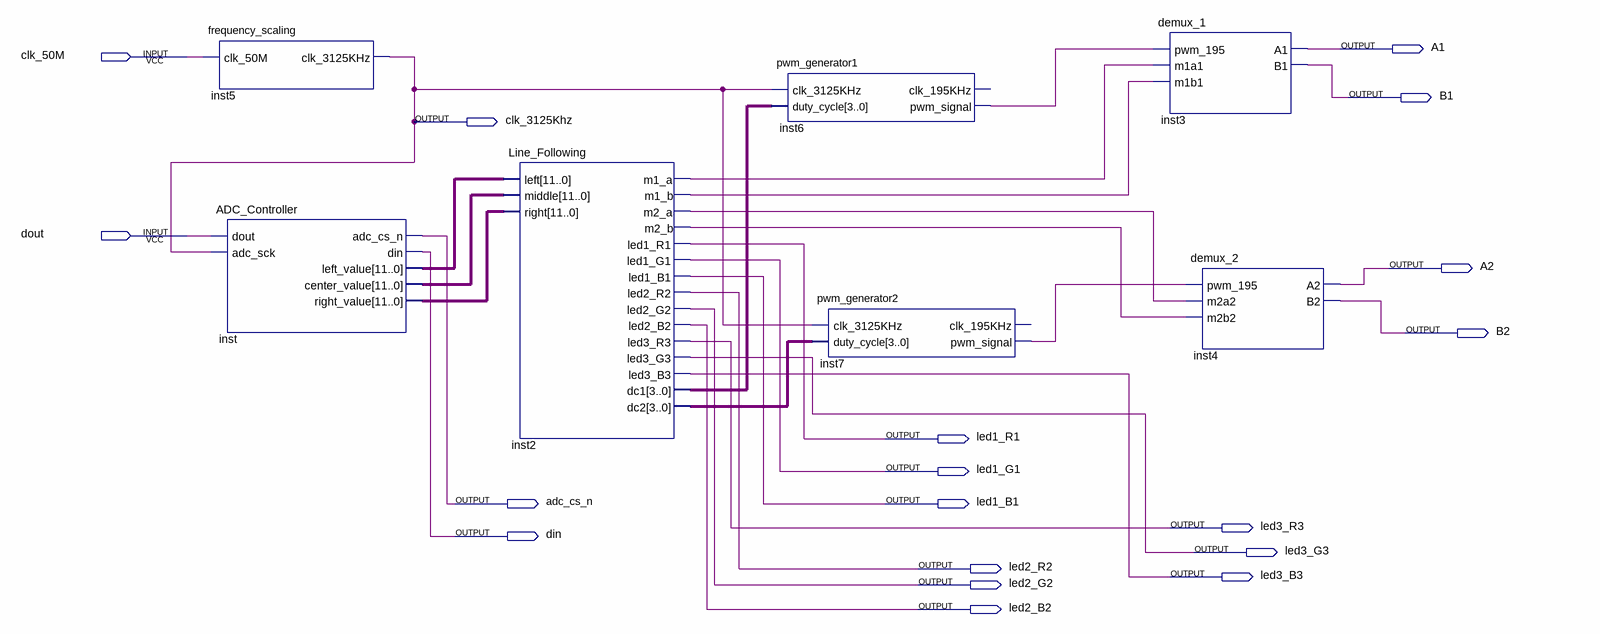
[diagram p0: schematic sheet]
// Quartus schematic line_follower1.bdf as structural Verilog: 7 symbols, 18 pins
module line_follower1 (
  input  clk_50M,
  input  dout,
  output A1,
  output B1,
  output clk_3125Khz,
  output A2,
  output B2,
  output led1_R1,
  output led1_G1,
  output adc_cs_n,
  output led1_B1,
  output led3_R3,
  output din,
  output led3_G3,
  output led2_R2,
  output led3_B3,
  output led2_G2,
  output led2_B2
);

  wire inst2_m1_a, inst2_m1_b, inst2_m2_a, inst2_m2_b, inst6_pwm_signal, inst7_pwm_signal;
  wire [3:0] inst2_dc1, inst2_dc2;
  wire [11:0] inst_center_value, inst_left_value, inst_right_value;

  frequency_scaling inst5 (.clk_50M(clk_50M), .clk_3125KHz(clk_3125Khz));
  ADC_Controller inst (
    .dout(dout), .adc_sck(clk_3125Khz), .adc_cs_n(adc_cs_n), .din(din), .left_value(inst_left_value),
    .center_value(inst_center_value), .right_value(inst_right_value));
  Line_Following inst2 (
    .left(inst_left_value), .middle(inst_center_value), .right(inst_right_value), .m1_a(inst2_m1_a),
    .m1_b(inst2_m1_b), .m2_a(inst2_m2_a), .m2_b(inst2_m2_b), .led1_R1(led1_R1), .led1_G1(led1_G1),
    .led1_B1(led1_B1), .led2_R2(led2_R2), .led2_G2(led2_G2), .led2_B2(led2_B2), .led3_R3(led3_R3),
    .led3_G3(led3_G3), .led3_B3(led3_B3), .dc1(inst2_dc1), .dc2(inst2_dc2));
  pwm_generator1 inst6 (
    .clk_3125KHz(clk_3125Khz), .duty_cycle(inst2_dc1), .pwm_signal(inst6_pwm_signal));  // open: clk_195KHz
  pwm_generator2 inst7 (
    .clk_3125KHz(clk_3125Khz), .duty_cycle(inst2_dc2), .pwm_signal(inst7_pwm_signal));  // open: clk_195KHz
  demux_1 inst3 (.pwm_195(inst6_pwm_signal), .m1a1(inst2_m1_a), .m1b1(inst2_m1_b), .A1(A1), .B1(B1));
  demux_2 inst4 (.pwm_195(inst7_pwm_signal), .m2a2(inst2_m2_a), .m2b2(inst2_m2_b), .A2(A2), .B2(B2));
endmodule
